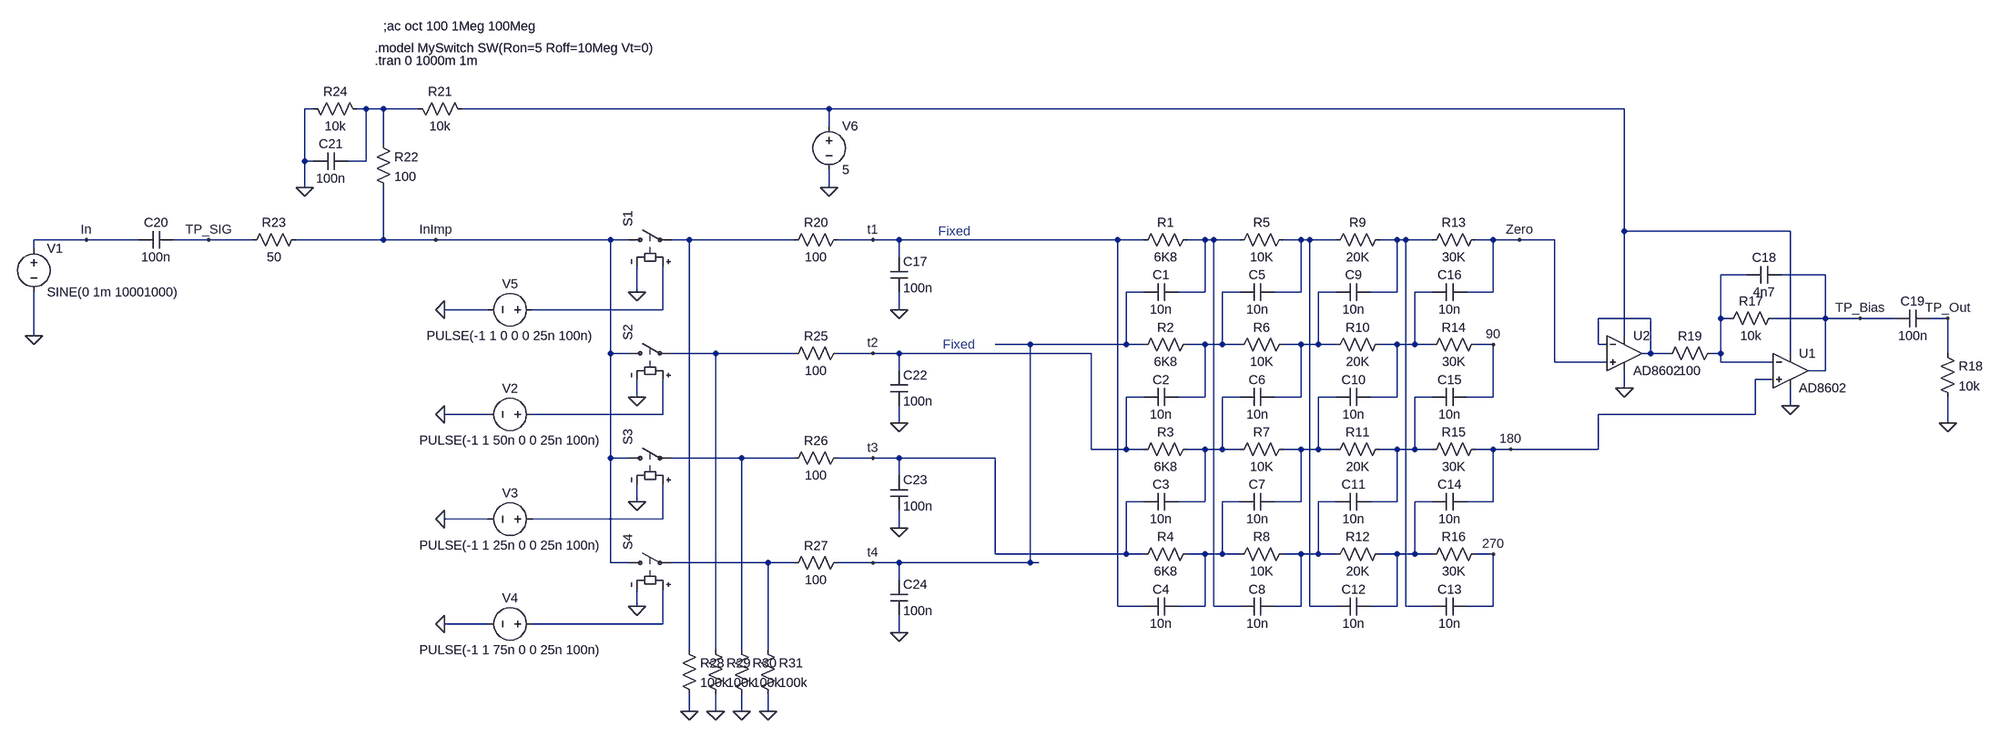
[diagram p0: schematic 4020 QSD 4.asc]
4020 QSD 4.asc, the LTspice schematic file:
Version 4
SHEET 1 2244 1668
WIRE -816 544 -832 544
WIRE -720 544 -736 544
WIRE -688 544 -720 544
WIRE -624 544 -688 544
WIRE 128 544 -544 544
WIRE 1584 544 128 544
WIRE 128 576 128 544
WIRE -688 608 -688 544
WIRE -832 640 -832 544
WIRE -816 640 -832 640
WIRE -720 640 -720 544
WIRE -720 640 -752 640
WIRE -832 688 -832 640
WIRE 128 688 128 656
WIRE 1584 768 1584 544
WIRE 1888 768 1584 768
WIRE -1232 784 -1328 784
WIRE -1136 784 -1232 784
WIRE -1008 784 -1072 784
WIRE -928 784 -1008 784
WIRE -688 784 -688 688
WIRE -688 784 -848 784
WIRE -592 784 -688 784
WIRE -272 784 -592 784
WIRE -240 784 -272 784
WIRE -128 784 -160 784
WIRE 64 784 -128 784
WIRE 208 784 144 784
WIRE 256 784 208 784
WIRE 656 784 256 784
WIRE 704 784 656 784
WIRE 816 784 784 784
WIRE 832 784 816 784
WIRE 880 784 832 784
WIRE 992 784 960 784
WIRE 1008 784 992 784
WIRE 1056 784 1008 784
WIRE 1168 784 1136 784
WIRE 1184 784 1168 784
WIRE 1232 784 1184 784
WIRE 1344 784 1312 784
WIRE 1392 784 1344 784
WIRE 1456 784 1392 784
WIRE -1328 800 -1328 784
WIRE 256 816 256 784
WIRE 1808 848 1760 848
WIRE 1952 848 1872 848
WIRE -224 880 -224 832
WIRE 704 880 672 880
WIRE 816 880 816 784
WIRE 816 880 768 880
WIRE 880 880 848 880
WIRE 992 880 992 784
WIRE 992 880 944 880
WIRE 1056 880 1024 880
WIRE 1168 880 1168 784
WIRE 1168 880 1120 880
WIRE 1232 880 1200 880
WIRE 1344 880 1344 784
WIRE 1344 880 1296 880
WIRE -496 912 -576 912
WIRE -176 912 -176 832
WIRE -176 912 -416 912
WIRE 256 912 256 880
WIRE 1632 928 1536 928
WIRE 1760 928 1760 848
WIRE 1776 928 1760 928
WIRE 1952 928 1952 848
WIRE 1952 928 1856 928
WIRE 2016 928 1952 928
WIRE 2080 928 2016 928
WIRE 2176 928 2144 928
WIRE -1328 960 -1328 880
WIRE 1584 960 1584 768
WIRE 496 976 432 976
WIRE 672 976 672 880
WIRE 672 976 496 976
WIRE 704 976 672 976
WIRE 816 976 784 976
WIRE 848 976 848 880
WIRE 848 976 816 976
WIRE 880 976 848 976
WIRE 992 976 960 976
WIRE 1024 976 1024 880
WIRE 1024 976 992 976
WIRE 1056 976 1024 976
WIRE 1168 976 1136 976
WIRE 1200 976 1200 880
WIRE 1200 976 1168 976
WIRE 1232 976 1200 976
WIRE 1344 976 1312 976
WIRE 1536 976 1536 928
WIRE 1552 976 1536 976
WIRE -272 992 -272 784
WIRE -240 992 -272 992
WIRE -80 992 -160 992
WIRE 64 992 -80 992
WIRE 208 992 144 992
WIRE 256 992 208 992
WIRE 608 992 256 992
WIRE 1632 992 1632 928
WIRE 1632 992 1616 992
WIRE 1664 992 1632 992
WIRE 1760 992 1760 928
WIRE 1760 992 1744 992
WIRE 1888 992 1888 768
WIRE 2176 992 2176 928
WIRE 1456 1008 1456 784
WIRE 1552 1008 1456 1008
WIRE 1760 1008 1760 992
WIRE 1856 1008 1760 1008
WIRE 256 1024 256 992
WIRE 1952 1024 1952 928
WIRE 1952 1024 1920 1024
WIRE 1856 1040 1824 1040
WIRE 1584 1056 1584 1024
WIRE -224 1072 -224 1040
WIRE 704 1072 672 1072
WIRE 816 1072 816 976
WIRE 816 1072 768 1072
WIRE 880 1072 848 1072
WIRE 992 1072 992 976
WIRE 992 1072 944 1072
WIRE 1056 1072 1024 1072
WIRE 1168 1072 1168 976
WIRE 1168 1072 1120 1072
WIRE 1232 1072 1200 1072
WIRE 1344 1072 1344 976
WIRE 1344 1072 1296 1072
WIRE 1888 1088 1888 1056
WIRE -496 1104 -576 1104
WIRE -176 1104 -176 1040
WIRE -176 1104 -416 1104
WIRE 1824 1104 1824 1040
WIRE 1824 1104 1536 1104
WIRE 256 1120 256 1088
WIRE 2176 1120 2176 1072
WIRE 608 1168 608 992
WIRE 672 1168 672 1072
WIRE 672 1168 608 1168
WIRE 704 1168 672 1168
WIRE 816 1168 784 1168
WIRE 848 1168 848 1072
WIRE 848 1168 816 1168
WIRE 880 1168 848 1168
WIRE 992 1168 960 1168
WIRE 1024 1168 1024 1072
WIRE 1024 1168 992 1168
WIRE 1056 1168 1024 1168
WIRE 1168 1168 1136 1168
WIRE 1200 1168 1200 1072
WIRE 1200 1168 1168 1168
WIRE 1232 1168 1200 1168
WIRE 1344 1168 1312 1168
WIRE 1376 1168 1344 1168
WIRE 1536 1168 1536 1104
WIRE 1536 1168 1376 1168
WIRE -272 1184 -272 992
WIRE -240 1184 -272 1184
WIRE -32 1184 -160 1184
WIRE 64 1184 -32 1184
WIRE 208 1184 144 1184
WIRE 256 1184 208 1184
WIRE 432 1184 256 1184
WIRE 256 1216 256 1184
WIRE -224 1264 -224 1232
WIRE 704 1264 672 1264
WIRE 816 1264 816 1168
WIRE 816 1264 768 1264
WIRE 880 1264 848 1264
WIRE 992 1264 992 1168
WIRE 992 1264 944 1264
WIRE 1056 1264 1024 1264
WIRE 1168 1264 1168 1168
WIRE 1168 1264 1120 1264
WIRE 1232 1264 1200 1264
WIRE 1344 1264 1344 1168
WIRE 1344 1264 1296 1264
WIRE -496 1296 -576 1296
WIRE -176 1296 -176 1232
WIRE -176 1296 -416 1296
WIRE 256 1312 256 1280
WIRE 432 1360 432 1184
WIRE 672 1360 672 1264
WIRE 672 1360 432 1360
WIRE 704 1360 672 1360
WIRE 816 1360 784 1360
WIRE 848 1360 848 1264
WIRE 848 1360 816 1360
WIRE 880 1360 848 1360
WIRE 992 1360 960 1360
WIRE 1024 1360 1024 1264
WIRE 1024 1360 992 1360
WIRE 1056 1360 1024 1360
WIRE 1168 1360 1136 1360
WIRE 1200 1360 1200 1264
WIRE 1200 1360 1168 1360
WIRE 1232 1360 1200 1360
WIRE 1344 1360 1312 1360
WIRE -272 1376 -272 1184
WIRE -240 1376 -272 1376
WIRE 16 1376 -160 1376
WIRE 64 1376 16 1376
WIRE 208 1376 144 1376
WIRE 256 1376 208 1376
WIRE 496 1376 496 976
WIRE 496 1376 256 1376
WIRE 512 1376 496 1376
WIRE 256 1408 256 1376
WIRE -224 1456 -224 1424
WIRE 656 1456 656 784
WIRE 704 1456 656 1456
WIRE 816 1456 816 1360
WIRE 816 1456 768 1456
WIRE 832 1456 832 784
WIRE 880 1456 832 1456
WIRE 992 1456 992 1360
WIRE 992 1456 944 1456
WIRE 1008 1456 1008 784
WIRE 1056 1456 1008 1456
WIRE 1168 1456 1168 1360
WIRE 1168 1456 1120 1456
WIRE 1184 1456 1184 784
WIRE 1232 1456 1184 1456
WIRE 1344 1456 1344 1360
WIRE 1344 1456 1296 1456
WIRE -496 1488 -576 1488
WIRE -176 1488 -176 1424
WIRE -176 1488 -416 1488
WIRE 256 1504 256 1472
WIRE -128 1536 -128 784
WIRE -80 1536 -80 992
WIRE -32 1536 -32 1184
WIRE 16 1536 16 1376
WIRE -128 1648 -128 1616
WIRE -80 1648 -80 1616
WIRE -32 1648 -32 1616
WIRE 16 1648 16 1616
FLAG 1392 784 Zero
FLAG 1344 976 90
FLAG 1376 1168 180
FLAG 1344 1360 270
FLAG 1888 1088 0
FLAG 256 912 0
FLAG -224 880 0
FLAG -576 1104 0
FLAG -576 1296 0
FLAG -576 1488 0
FLAG -224 1072 0
FLAG -224 1264 0
FLAG -224 1456 0
FLAG 256 1120 0
FLAG 256 1312 0
FLAG 256 1504 0
FLAG 2176 1120 0
FLAG 2176 928 TP_Out
FLAG -576 912 0
FLAG 208 784 t1
FLAG 208 992 t2
FLAG 208 1184 t3
FLAG 208 1376 t4
FLAG -592 784 InImp
FLAG 128 688 0
FLAG 1584 1056 0
FLAG -1328 960 0
FLAG -1232 784 In
FLAG -1008 784 TP_SIG
FLAG -832 688 0
FLAG -128 1648 0
FLAG -80 1648 0
FLAG -32 1648 0
FLAG 16 1648 0
FLAG 2016 928 TP_Bias
SYMBOL res 688 800 R270
WINDOW 0 32 56 VTop 2
WINDOW 3 0 56 VBottom 2
SYMATTR InstName R1
SYMATTR Value 6K8
SYMBOL cap 704 896 R270
WINDOW 0 32 32 VTop 2
WINDOW 3 0 32 VBottom 2
SYMATTR InstName C1
SYMATTR Value 10n
SYMBOL cap 704 1088 R270
WINDOW 0 32 32 VTop 2
WINDOW 3 0 32 VBottom 2
SYMATTR InstName C2
SYMATTR Value 10n
SYMBOL cap 704 1280 R270
WINDOW 0 32 32 VTop 2
WINDOW 3 0 32 VBottom 2
SYMATTR InstName C3
SYMATTR Value 10n
SYMBOL cap 704 1472 R270
WINDOW 0 32 32 VTop 2
WINDOW 3 0 32 VBottom 2
SYMATTR InstName C4
SYMATTR Value 10n
SYMBOL res 864 800 R270
WINDOW 0 32 56 VTop 2
WINDOW 3 0 56 VBottom 2
SYMATTR InstName R5
SYMATTR Value 10K
SYMBOL cap 880 896 R270
WINDOW 0 32 32 VTop 2
WINDOW 3 0 32 VBottom 2
SYMATTR InstName C5
SYMATTR Value 10n
SYMBOL cap 880 1088 R270
WINDOW 0 32 32 VTop 2
WINDOW 3 0 32 VBottom 2
SYMATTR InstName C6
SYMATTR Value 10n
SYMBOL cap 880 1280 R270
WINDOW 0 32 32 VTop 2
WINDOW 3 0 32 VBottom 2
SYMATTR InstName C7
SYMATTR Value 10n
SYMBOL cap 880 1472 R270
WINDOW 0 32 32 VTop 2
WINDOW 3 0 32 VBottom 2
SYMATTR InstName C8
SYMATTR Value 10n
SYMBOL res 1040 800 R270
WINDOW 0 32 56 VTop 2
WINDOW 3 0 56 VBottom 2
SYMATTR InstName R9
SYMATTR Value 20K
SYMBOL res 1216 800 R270
WINDOW 0 32 56 VTop 2
WINDOW 3 0 56 VBottom 2
SYMATTR InstName R13
SYMATTR Value 30K
SYMBOL res 1760 944 R270
WINDOW 0 32 56 VTop 2
WINDOW 3 0 56 VBottom 2
SYMATTR InstName R17
SYMATTR Value 10k
SYMBOL voltage -1328 784 R0
WINDOW 39 24 124 Left 2
SYMATTR Value2 AC 1
SYMATTR InstName V1
SYMATTR Value SINE(0 1m 10001000)
SYMBOL sw -256 784 R270
SYMATTR InstName S1
SYMATTR Value ""
SYMATTR SpiceModel MySwitch
SYMBOL cap 240 816 R0
SYMATTR InstName C17
SYMATTR Value 100n
SYMBOL sw -256 992 R270
SYMATTR InstName S2
SYMATTR Value ""
SYMATTR SpiceModel MySwitch
SYMBOL sw -256 1184 R270
SYMATTR InstName S3
SYMATTR Value ""
SYMATTR SpiceModel MySwitch
SYMBOL sw -256 1376 R270
SYMATTR InstName S4
SYMATTR Value ""
SYMATTR SpiceModel MySwitch
SYMBOL voltage -400 1104 R90
WINDOW 0 -32 56 VBottom 2
WINDOW 3 32 56 VTop 2
WINDOW 123 32 56 VTop 2
WINDOW 39 32 56 VTop 2
SYMATTR InstName V2
SYMATTR Value PULSE(-1 1 50n 0 0 25n 100n)
SYMBOL voltage -400 1296 R90
WINDOW 0 -32 56 VBottom 2
WINDOW 3 32 56 VTop 2
WINDOW 123 32 56 VTop 2
WINDOW 39 32 56 VTop 2
SYMATTR InstName V3
SYMATTR Value PULSE(-1 1 25n 0 0 25n 100n)
SYMBOL voltage -400 1488 R90
WINDOW 0 -32 56 VBottom 2
WINDOW 3 32 56 VTop 2
WINDOW 123 32 56 VTop 2
WINDOW 39 32 56 VTop 2
SYMATTR InstName V4
SYMATTR Value PULSE(-1 1 75n 0 0 25n 100n)
SYMBOL cap 1872 832 R90
WINDOW 0 0 32 VBottom 2
WINDOW 3 32 32 VTop 2
SYMATTR InstName C18
SYMATTR Value 4n7
SYMBOL cap 2080 944 R270
WINDOW 0 32 32 VTop 2
WINDOW 3 0 32 VBottom 2
SYMATTR InstName C19
SYMATTR Value 100n
SYMBOL res 2160 976 R0
SYMATTR InstName R18
SYMATTR Value 10k
SYMBOL voltage -400 912 R90
WINDOW 0 -32 56 VBottom 2
WINDOW 3 32 56 VTop 2
WINDOW 123 32 56 VTop 2
WINDOW 39 32 56 VTop 2
SYMATTR InstName V5
SYMATTR Value PULSE(-1 1 0 0 0 25n 100n)
SYMBOL Opamps\\AD8602 1888 960 R0
SYMATTR InstName U1
SYMBOL voltage 128 560 R0
WINDOW 123 0 0 Left 2
WINDOW 39 0 0 Left 2
SYMATTR InstName V6
SYMATTR Value 5
SYMBOL Opamps\\AD8602 1584 928 R0
SYMATTR InstName U2
SYMBOL res 1648 1008 R270
WINDOW 0 32 56 VTop 2
WINDOW 3 0 56 VBottom 2
SYMATTR InstName R19
SYMATTR Value 100
SYMBOL cap -1136 800 R270
WINDOW 0 32 32 VTop 2
WINDOW 3 0 32 VBottom 2
SYMATTR InstName C20
SYMATTR Value 100n
SYMBOL res 160 768 R90
WINDOW 0 0 56 VBottom 2
WINDOW 3 32 56 VTop 2
SYMATTR InstName R20
SYMATTR Value 100
SYMBOL res -528 560 M270
WINDOW 0 32 56 VTop 2
WINDOW 3 0 56 VBottom 2
SYMATTR InstName R21
SYMATTR Value 10k
SYMBOL res -704 592 R0
SYMATTR InstName R22
SYMATTR Value 100
SYMBOL res -832 768 R90
WINDOW 0 0 56 VBottom 2
WINDOW 3 32 56 VTop 2
SYMATTR InstName R23
SYMATTR Value 50
SYMBOL res -720 560 M270
WINDOW 0 32 56 VTop 2
WINDOW 3 0 56 VBottom 2
SYMATTR InstName R24
SYMATTR Value 10k
SYMBOL cap -816 656 R270
WINDOW 0 32 32 VTop 2
WINDOW 3 0 32 VBottom 2
SYMATTR InstName C21
SYMATTR Value 100n
SYMBOL cap 240 1024 R0
SYMATTR InstName C22
SYMATTR Value 100n
SYMBOL cap 240 1216 R0
SYMATTR InstName C23
SYMATTR Value 100n
SYMBOL cap 240 1408 R0
SYMATTR InstName C24
SYMATTR Value 100n
SYMBOL res 160 976 R90
WINDOW 0 0 56 VBottom 2
WINDOW 3 32 56 VTop 2
SYMATTR InstName R25
SYMATTR Value 100
SYMBOL res 160 1168 R90
WINDOW 0 0 56 VBottom 2
WINDOW 3 32 56 VTop 2
SYMATTR InstName R26
SYMATTR Value 100
SYMBOL res 160 1360 R90
WINDOW 0 0 56 VBottom 2
WINDOW 3 32 56 VTop 2
SYMATTR InstName R27
SYMATTR Value 100
SYMBOL cap 1056 896 R270
WINDOW 0 32 32 VTop 2
WINDOW 3 0 32 VBottom 2
SYMATTR InstName C9
SYMATTR Value 10n
SYMBOL cap 1056 1088 R270
WINDOW 0 32 32 VTop 2
WINDOW 3 0 32 VBottom 2
SYMATTR InstName C10
SYMATTR Value 10n
SYMBOL cap 1056 1280 R270
WINDOW 0 32 32 VTop 2
WINDOW 3 0 32 VBottom 2
SYMATTR InstName C11
SYMATTR Value 10n
SYMBOL cap 1056 1472 R270
WINDOW 0 32 32 VTop 2
WINDOW 3 0 32 VBottom 2
SYMATTR InstName C12
SYMATTR Value 10n
SYMBOL cap 1232 1472 R270
WINDOW 0 32 32 VTop 2
WINDOW 3 0 32 VBottom 2
SYMATTR InstName C13
SYMATTR Value 10n
SYMBOL cap 1232 1280 R270
WINDOW 0 32 32 VTop 2
WINDOW 3 0 32 VBottom 2
SYMATTR InstName C14
SYMATTR Value 10n
SYMBOL cap 1232 1088 R270
WINDOW 0 32 32 VTop 2
WINDOW 3 0 32 VBottom 2
SYMATTR InstName C15
SYMATTR Value 10n
SYMBOL cap 1232 896 R270
WINDOW 0 32 32 VTop 2
WINDOW 3 0 32 VBottom 2
SYMATTR InstName C16
SYMATTR Value 10n
SYMBOL res 864 992 R270
WINDOW 0 32 56 VTop 2
WINDOW 3 0 56 VBottom 2
SYMATTR InstName R6
SYMATTR Value 10K
SYMBOL res 864 1184 R270
WINDOW 0 32 56 VTop 2
WINDOW 3 0 56 VBottom 2
SYMATTR InstName R7
SYMATTR Value 10K
SYMBOL res 864 1376 R270
WINDOW 0 32 56 VTop 2
WINDOW 3 0 56 VBottom 2
SYMATTR InstName R8
SYMATTR Value 10K
SYMBOL res 1040 992 R270
WINDOW 0 32 56 VTop 2
WINDOW 3 0 56 VBottom 2
SYMATTR InstName R10
SYMATTR Value 20K
SYMBOL res 1040 1184 R270
WINDOW 0 32 56 VTop 2
WINDOW 3 0 56 VBottom 2
SYMATTR InstName R11
SYMATTR Value 20K
SYMBOL res 1040 1376 R270
WINDOW 0 32 56 VTop 2
WINDOW 3 0 56 VBottom 2
SYMATTR InstName R12
SYMATTR Value 20K
SYMBOL res 1216 992 R270
WINDOW 0 32 56 VTop 2
WINDOW 3 0 56 VBottom 2
SYMATTR InstName R14
SYMATTR Value 30K
SYMBOL res 1216 1184 R270
WINDOW 0 32 56 VTop 2
WINDOW 3 0 56 VBottom 2
SYMATTR InstName R15
SYMATTR Value 30K
SYMBOL res 1216 1376 R270
WINDOW 0 32 56 VTop 2
WINDOW 3 0 56 VBottom 2
SYMATTR InstName R16
SYMATTR Value 30K
SYMBOL res 688 992 R270
WINDOW 0 32 56 VTop 2
WINDOW 3 0 56 VBottom 2
SYMATTR InstName R2
SYMATTR Value 6K8
SYMBOL res 688 1184 R270
WINDOW 0 32 56 VTop 2
WINDOW 3 0 56 VBottom 2
SYMATTR InstName R3
SYMATTR Value 6K8
SYMBOL res 688 1376 R270
WINDOW 0 32 56 VTop 2
WINDOW 3 0 56 VBottom 2
SYMATTR InstName R4
SYMATTR Value 6K8
SYMBOL res -144 1520 R0
SYMATTR InstName R28
SYMATTR Value 100k
SYMBOL res -96 1520 R0
SYMATTR InstName R29
SYMATTR Value 100k
SYMBOL res -48 1520 R0
SYMATTR InstName R30
SYMATTR Value 100k
SYMBOL res 0 1520 R0
SYMATTR InstName R31
SYMATTR Value 100k
TEXT -704 456 Left 2 !.tran 0 1000m 1m
TEXT -704 432 Left 2 !.model MySwitch SW(Ron=5 Roff=10Meg Vt=0)
TEXT -688 392 Left 2 !;ac oct 100 1Meg 100Meg
TEXT 328 768 Left 2 ;Fixed
TEXT 336 976 Left 2 ;Fixed

The netlist it stands for:
* 4020 QSD 4.asc
R1 t1 N004 6K8
C1 t4 N004 10n
C2 t2 N008 10n
C3 t3 N014 10n
C4 t1 N019 10n
R5 N004 N005 10K
C5 N008 N005 10n
C6 N014 N009 10n
C7 N019 N015 10n
C8 N004 N020 10n
R9 N005 N006 20K
R13 N006 Zero 30K
R17 N007 TP_Bias 10k
V1 In 0 SINE(0 1m 10001000) AC 1
S1 InImp N003 N011 0 MySwitch
C17 t1 0 100n
S2 InImp N013 N017 0 MySwitch
S3 InImp N018 N022 0 MySwitch
S4 InImp N023 N024 0 MySwitch
V2 N017 0 PULSE(-1 1 50n 0 0 25n 100n)
V3 N022 0 PULSE(-1 1 25n 0 0 25n 100n)
V4 N024 0 PULSE(-1 1 75n 0 0 25n 100n)
C18 TP_Bias N007 4n7
C19 TP_Bias TP_Out 100n
R18 TP_Out 0 10k
V5 N011 0 PULSE(-1 1 0 0 0 25n 100n)
XU1 180 N007 N002 0 TP_Bias AD8602  ; pins In+ In- V+ V- OUT
V6 N002 0 5
XU2 Zero N012 N002 0 N012 AD8602  ; pins In+ In- V+ V- OUT
R19 N012 N007 100
C20 In TP_SIG 100n
R20 t1 N003 100
R21 N002 N001 10k
R22 N001 InImp 100
R23 InImp TP_SIG 50
R24 N001 0 10k
C21 0 N001 100n
C22 t2 0 100n
C23 t3 0 100n
C24 t4 0 100n
R25 t2 N013 100
R26 t3 N018 100
R27 t4 N023 100
C9 N009 N006 10n
C10 N015 N010 10n
C11 N020 N016 10n
C12 N005 N021 10n
C13 N006 270 10n
C14 N021 180 10n
C15 N016 90 10n
C16 N010 Zero 10n
R6 N008 N009 10K
R7 N014 N015 10K
R8 N019 N020 10K
R10 N009 N010 20K
R11 N015 N016 20K
R12 N020 N021 20K
R14 N010 90 30K
R15 N016 180 30K
R16 N021 270 30K
R2 t4 N008 6K8
R3 t2 N014 6K8
R4 t3 N019 6K8
R28 N003 0 100k
R29 N013 0 100k
R30 N018 0 100k
R31 N023 0 100k
.tran 0 1000m 1m
.model MySwitch SW(Ron=5 Roff=10Meg Vt=0)
;ac oct 100 1Meg 100Meg
* Fixed
* Fixed
.backanno
.end